# Altium schematic sheet Top Level.SchDoc
size A3
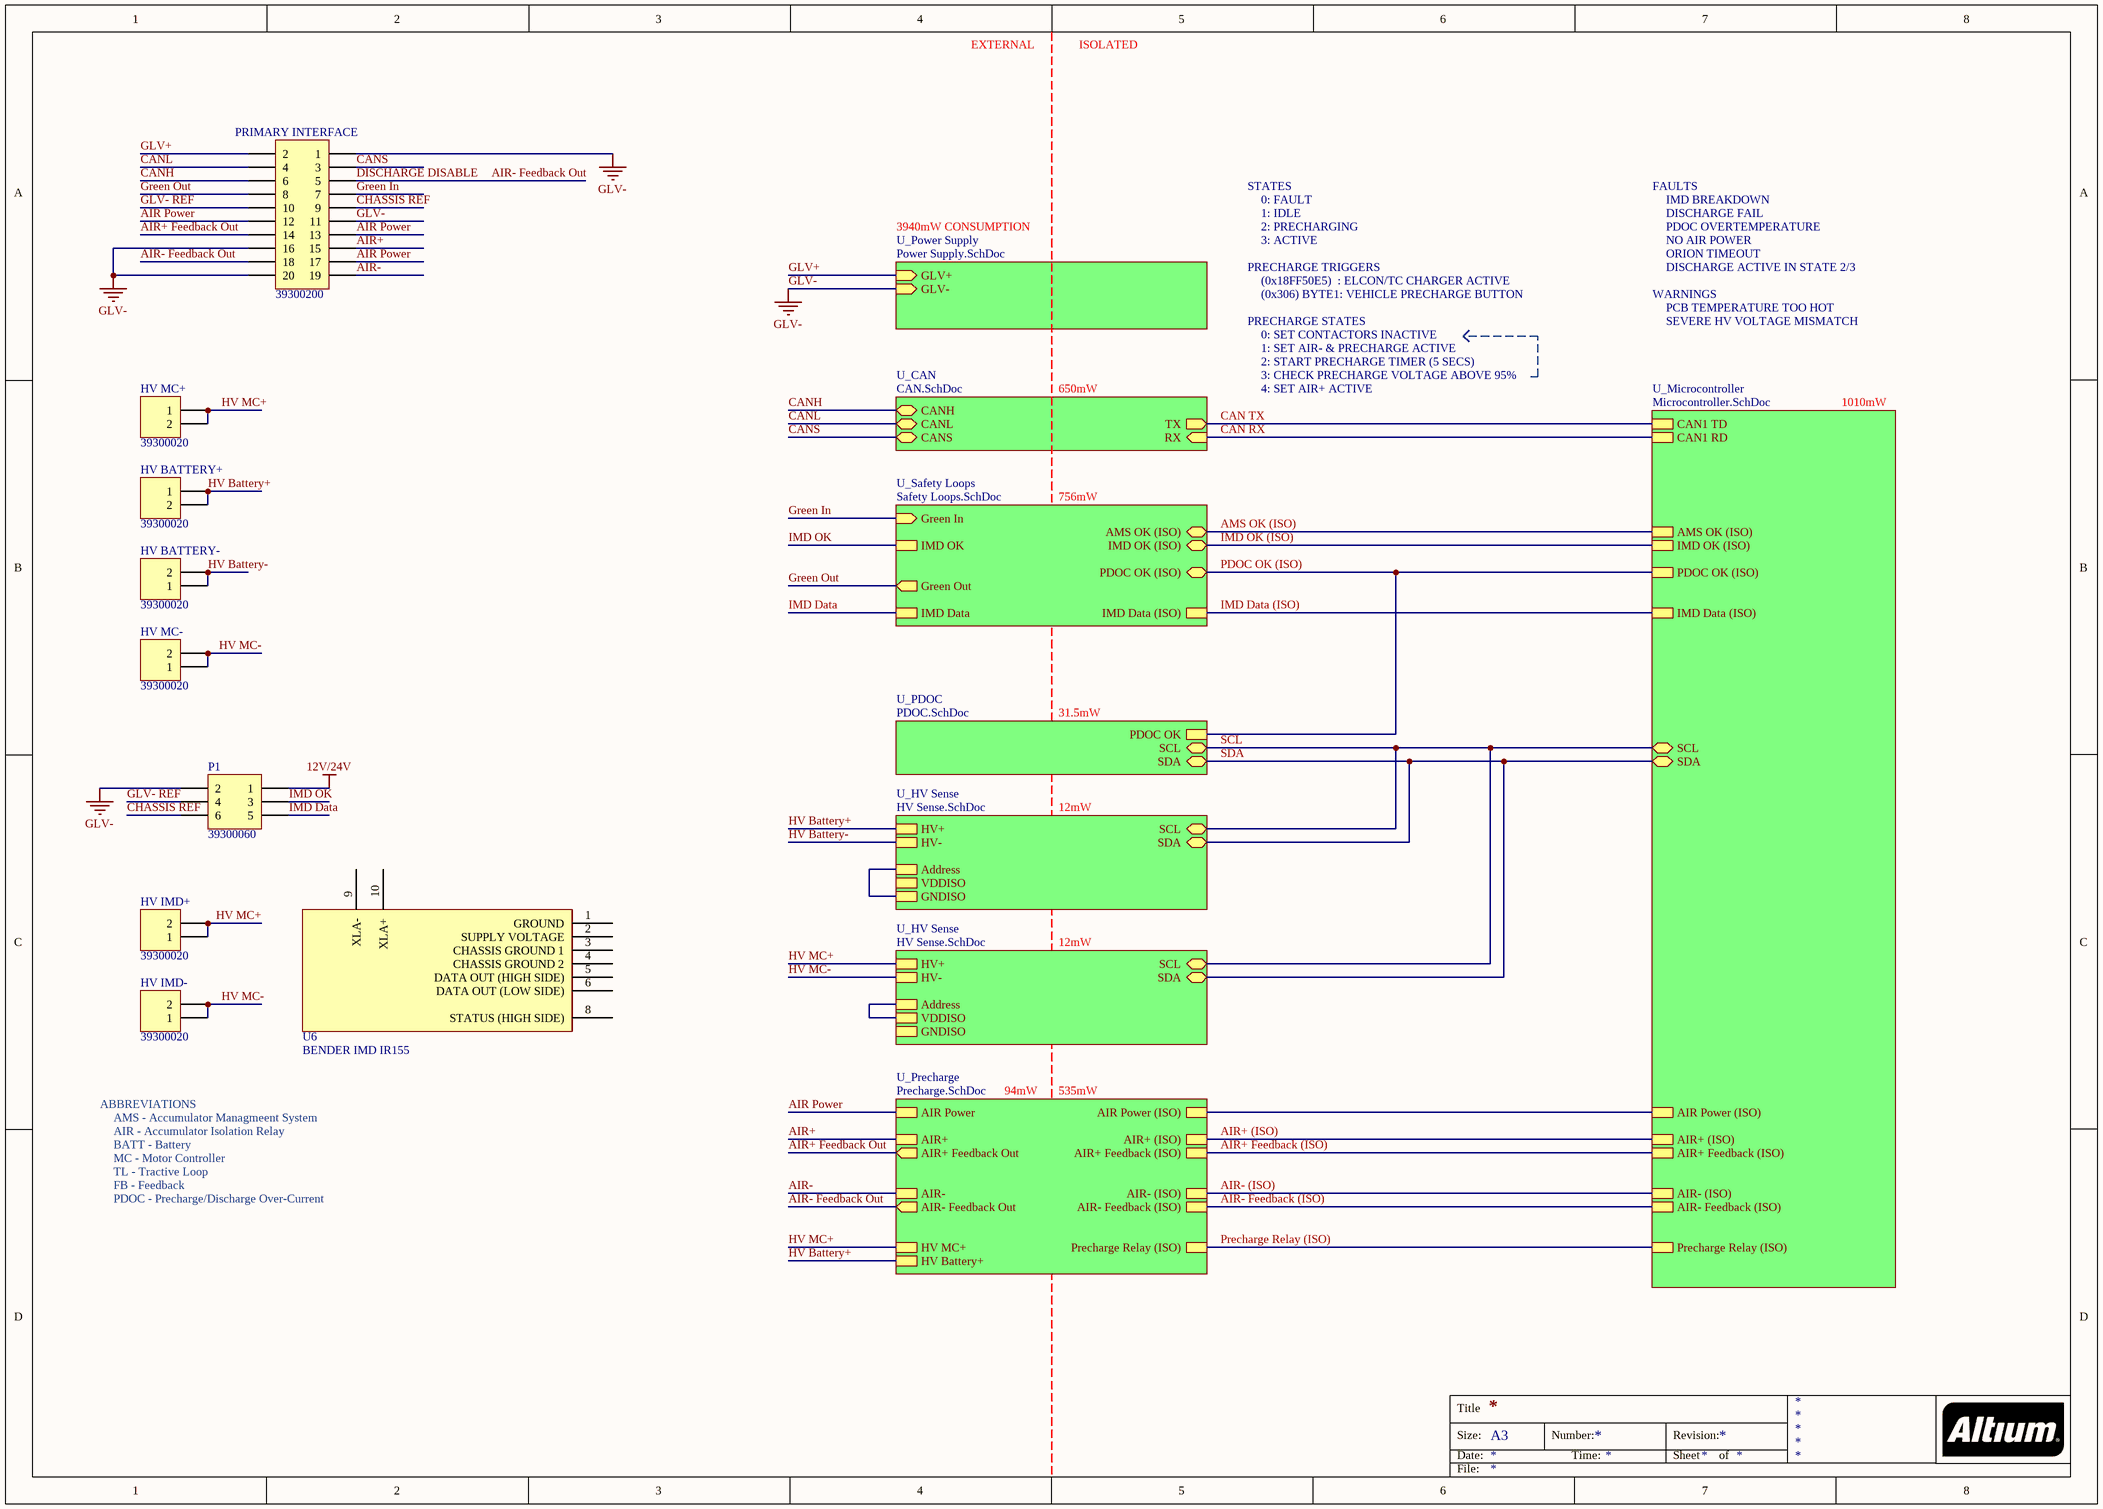
[diagram p0: Top Level.SchDoc]

## Parts
HV_BATTERY+  39300020  [39300020]
HV_BATTERY-  39300020  [39300020]
HV_IMD+  39300020  [39300020]
HV_IMD-  39300020  [39300020]
HV_MC+  39300020  [39300020]
HV_MC-  39300020  [39300020]
P1  39300060  [39300060]
PRIMARY_INTERFACE  39300200  [39300200]
U6  BENDER IMD IR155  [BENDER IMD IR155]

## Sub-sheets
U_CAN = CAN.SchDoc: CANH (bidir), CANL (bidir), CANS (bidir), RX (in), TX (out)
U_HV Sense = HV Sense.SchDoc: HV+, HV-, SCL (bidir), SDA (bidir), Address, VDDISO, GNDISO
U_HV Sense = HV Sense.SchDoc: HV+, HV-, SCL (bidir), SDA (bidir), Address, VDDISO, GNDISO
U_Microcontroller = Microcontroller.SchDoc: AIR- Feedback (ISO), AIR+ Feedback (ISO), AIR- (ISO), Precharge Relay (ISO), AIR+ (ISO), CAN1 TD, CAN1 RD, AIR Power (ISO), IMD OK (ISO), PDOC OK (ISO), AMS OK (ISO), IMD Data (ISO), SCL (bidir), SDA (bidir)
U_PDOC = PDOC.SchDoc: PDOC OK, SCL (bidir), SDA (bidir)
U_Power Supply = Power Supply.SchDoc: GLV+ (in), GLV- (in)
U_Precharge = Precharge.SchDoc: AIR Power, AIR- (ISO), AIR- Feedback Out (out), AIR- Feedback (ISO), AIR-, AIR+, AIR+ Feedback Out (out), AIR+ (ISO), AIR+ Feedback (ISO), Precharge Relay (ISO), HV MC+, HV Battery+, AIR Power (ISO)
U_Safety Loops = Safety Loops.SchDoc: IMD OK (ISO) (bidir), AMS OK (ISO) (bidir), PDOC OK (ISO) (bidir), Green In (in), IMD OK, Green Out (out), IMD Data, IMD Data (ISO)

## Nets
12V/24V: P1.1
GLV-: P1.2 PRIMARY_INTERFACE.1 PRIMARY_INTERFACE.11 PRIMARY_INTERFACE.16 PRIMARY_INTERFACE.20 ; sheet U_Power Supply/GLV-
AIR Power: PRIMARY_INTERFACE.12 PRIMARY_INTERFACE.13 PRIMARY_INTERFACE.17 ; sheet U_Precharge/AIR Power
AIR+: PRIMARY_INTERFACE.15 ; sheet U_Precharge/AIR+
AIR+ (ISO): sheet U_Precharge/AIR+ (ISO), sheet U_Microcontroller/AIR+ (ISO)
AIR+ Feedback (ISO): sheet U_Precharge/AIR+ Feedback (ISO), sheet U_Microcontroller/AIR+ Feedback (ISO)
AIR+ Feedback Out: PRIMARY_INTERFACE.14 ; sheet U_Precharge/AIR+ Feedback Out
AIR-: PRIMARY_INTERFACE.19 ; sheet U_Precharge/AIR-
AIR- (ISO): sheet U_Precharge/AIR- (ISO), sheet U_Microcontroller/AIR- (ISO)
AIR- Feedback (ISO): sheet U_Precharge/AIR- Feedback (ISO), sheet U_Microcontroller/AIR- Feedback (ISO)
AIR- Feedback Out: PRIMARY_INTERFACE.5 PRIMARY_INTERFACE.18 ; sheet U_Precharge/AIR- Feedback Out  [also labelled DISCHARGE DISABLE]
AMS OK (ISO): sheet U_Microcontroller/AMS OK (ISO), sheet U_Safety Loops/AMS OK (ISO)
CAN RX: sheet U_CAN/RX, sheet U_Microcontroller/CAN1 RD
CAN TX: sheet U_CAN/TX, sheet U_Microcontroller/CAN1 TD
CANH: PRIMARY_INTERFACE.6 ; sheet U_CAN/CANH
CANL: PRIMARY_INTERFACE.4 ; sheet U_CAN/CANL
CANS: PRIMARY_INTERFACE.3 ; sheet U_CAN/CANS
CHASSIS REF: P1.6 PRIMARY_INTERFACE.9
GLV+: PRIMARY_INTERFACE.2 ; sheet U_Power Supply/GLV+
GLV- REF: P1.4 PRIMARY_INTERFACE.10
Green In: PRIMARY_INTERFACE.7 ; sheet U_Safety Loops/Green In
Green Out: PRIMARY_INTERFACE.8 ; sheet U_Safety Loops/Green Out
HV Battery+: HV_BATTERY+.1 HV_BATTERY+.2 ; sheet U_Precharge/HV Battery+, sheet U_HV Sense/HV+
HV Battery-: HV_BATTERY-.1 HV_BATTERY-.2 ; sheet U_HV Sense/HV-
HV MC+: HV_IMD+.1 HV_IMD+.2 HV_MC+.1 HV_MC+.2 ; sheet U_Precharge/HV MC+, sheet U_HV Sense/HV+
HV MC-: HV_IMD-.1 HV_IMD-.2 HV_MC-.1 HV_MC-.2 ; sheet U_HV Sense/HV-
IMD Data: P1.5 ; sheet U_Safety Loops/IMD Data
IMD Data (ISO): sheet U_Microcontroller/IMD Data (ISO), sheet U_Safety Loops/IMD Data (ISO)
IMD OK: P1.3 ; sheet U_Safety Loops/IMD OK
IMD OK (ISO): sheet U_Microcontroller/IMD OK (ISO), sheet U_Safety Loops/IMD OK (ISO)
PDOC OK (ISO): sheet U_Microcontroller/PDOC OK (ISO), sheet U_Safety Loops/PDOC OK (ISO), sheet U_PDOC/PDOC OK
Precharge Relay (ISO): sheet U_Precharge/Precharge Relay (ISO), sheet U_Microcontroller/Precharge Relay (ISO)
SCL: sheet U_Microcontroller/SCL, sheet U_HV Sense/SCL, sheet U_HV Sense/SCL, sheet U_PDOC/SCL
SDA: sheet U_Microcontroller/SDA, sheet U_HV Sense/SDA, sheet U_HV Sense/SDA, sheet U_PDOC/SDA
(unnamed): sheet U_Precharge/AIR Power (ISO), sheet U_Microcontroller/AIR Power (ISO)
(unnamed): sheet U_HV Sense/Address, sheet U_HV Sense/GNDISO
(unnamed): sheet U_HV Sense/Address, sheet U_HV Sense/VDDISO

Not connected (* = marked no-connect by the designer): U6 1(GROUND) 2(SUPPLY_VOLTAGE) 3(CHASSIS_GROUND_1) 4(CHASSIS_GROUND_2) 5(DATA_OUT_(HIGH_SIDE)) 6(DATA_OUT_(LOW_SIDE)) 8(STATUS_(HIGH_SIDE)) 9(XLA-) 10(XLA+)

## Notes on the sheet
- EXTERNAL
- ISOLATED
- 3940mW CONSUMPTION
- STATES
- 0: FAULT
- 1: IDLE
- 2: PRECHARGING
- 3: ACTIVE
- FAULTS
- IMD BREAKDOWN
- DISCHARGE FAIL
- PDOC OVERTEMPERATURE
- NO AIR POWER
- PRECHARGE TRIGGERS
- (0x18FF50E5)  : ELCON/TC CHARGER ACTIVE
- (0x306) BYTE1: VEHICLE PRECHARGE BUTTON
- WARNINGS
- PCB TEMPERATURE TOO HOT
- ORION TIMEOUT
- DISCHARGE ACTIVE IN STATE 2/3
- PRECHARGE STATES
- 1: SET AIR- & PRECHARGE ACTIVE
- 2: START PRECHARGE TIMER (5 SECS)
- 3: CHECK PRECHARGE VOLTAGE ABOVE 95%
- 0: SET CONTACTORS INACTIVE
- SEVERE HV VOLTAGE MISMATCH
- 650mW
- 4: SET AIR+ ACTIVE
- 1010mW
- 756mW
- 31.5mW
- 12mW
- ABBREVIATIONS
- AMS - Accumulator Managmeent System
- 94mW
- 535mW
- TL - Tractive Loop
- FB - Feedback
- BATT - Battery
- MC - Motor Controller
- AIR - Accumulator Isolation Relay
- PDOC - Precharge/Discharge Over-Current
- Title
- Size:
- Date:
- A3
- Number:
- Time:
- Revision:
- Sheet
- of
- File:

## Library data of the parts
HV_BATTERY+ HV_BATTERY- HV_IMD+ HV_IMD- HV_MC+ HV_MC- = 39300020: Positions: 2; Pitch: 4.2mm; Row Spacing: 5.5mm; Angle: 90; Flange: No; Contact: Tin; Part Number: 39300020; Digikey Part Number: WM21351-ND
P1 = 39300060: Positions: 6; Pitch: 4.2mm; Row Spacing: 5.5mm; Angle: 90; Flange: No; Contact: Tin; Part Number: 39300060; Digikey Part Number: WM21353-ND
PRIMARY_INTERFACE = 39300200: Positions: 20; Pitch: 4.2mm; Row Spacing: 5.5mm; Angle: 90; Flange: No; Contact: Tin; Part Number: 39300200; Digikey Part Number: WM21360-ND
U6 = BENDER IMD IR155: Insulation monitoring device (IMD) for unearthed DC drive systems (IT systems) in electric vehicles.; Part Number: BENDER IMD IR155; Manufacturer: Bender; Link: https://www.bender.de/en/products/insulation-monitoring/isometer_ir155-3203ir155-3204